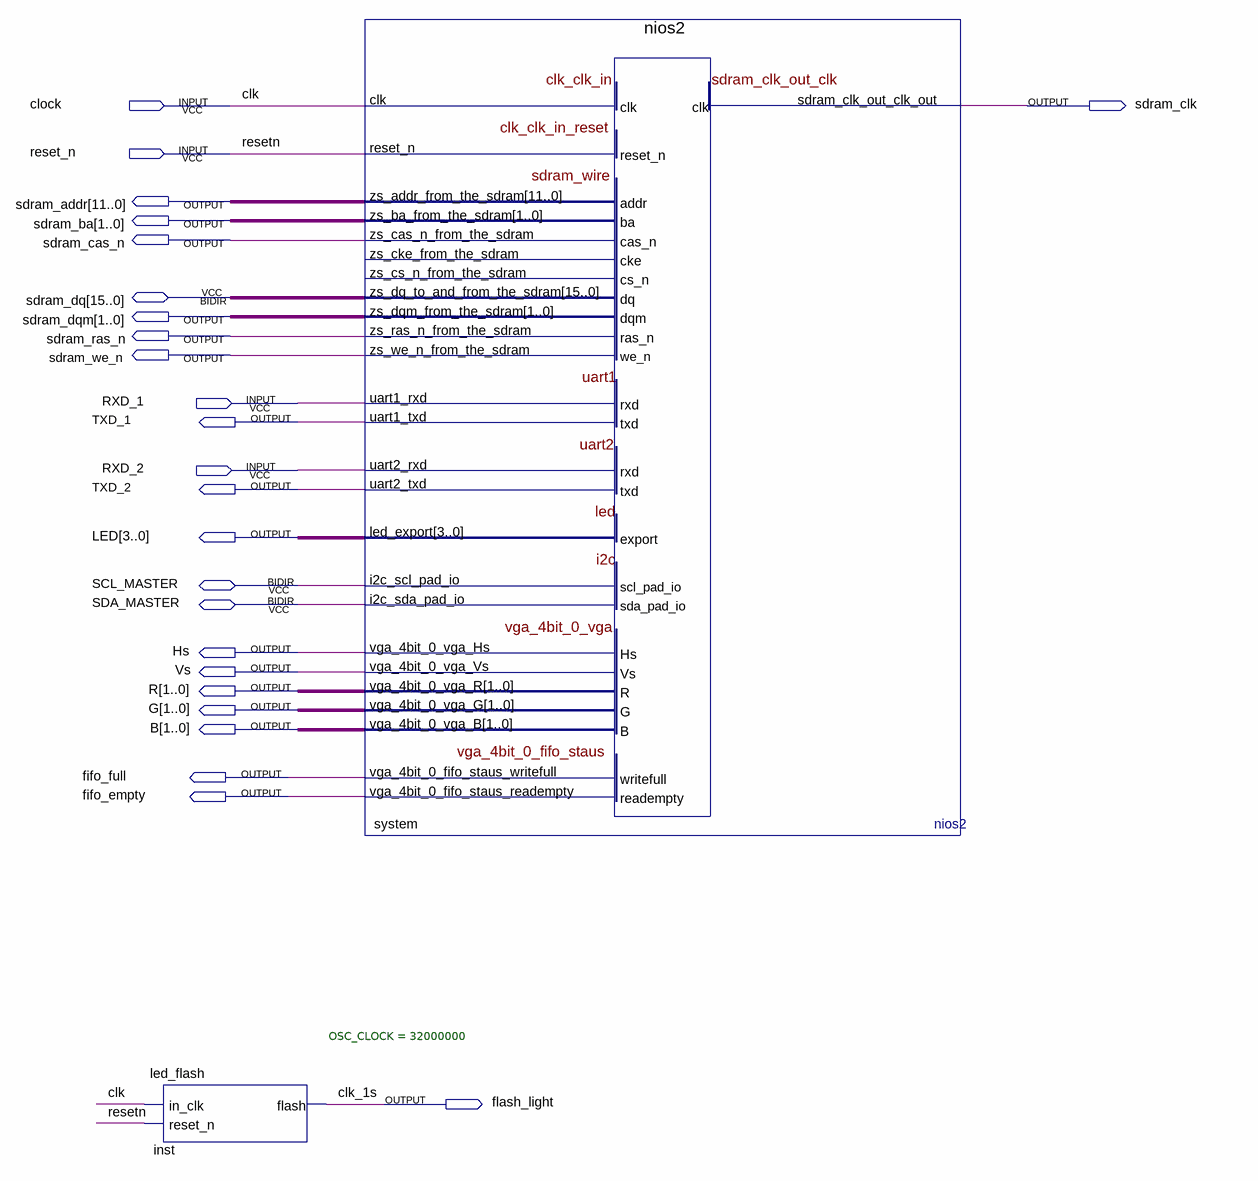
[diagram p0: schematic sheet]
// Quartus schematic EP2C8_Qsys.bdf as structural Verilog: 2 symbols, 25 pins
module EP2C8_Qsys (
  input  clock,
  input  reset_n,
  input  RXD_1,
  input  RXD_2,
  inout  [15:0] sdram_dq,
  inout  SCL_MASTER,
  inout  SDA_MASTER,
  output sdram_clk,
  output [11:0] sdram_addr,
  output [1:0] sdram_ba,
  output sdram_cas_n,
  output [1:0] sdram_dqm,
  output sdram_ras_n,
  output sdram_we_n,
  output TXD_1,
  output TXD_2,
  output [3:0] LED,
  output Hs,
  output Vs,
  output [1:0] R,
  output [1:0] G,
  output [1:0] B,
  output fifo_full,
  output fifo_empty,
  output flash_light
);

  led_flash #(.OSC_CLOCK(32000000)) inst (.in_clk(clock), .reset_n(reset_n), .flash(flash_light));
  nios2 system (
    .clk(clock), .reset_n(reset_n), .uart1_rxd(RXD_1), .uart2_rxd(RXD_2),
    .zs_addr_from_the_sdram(sdram_addr), .zs_ba_from_the_sdram(sdram_ba),
    .zs_cas_n_from_the_sdram(sdram_cas_n), .zs_dqm_from_the_sdram(sdram_dqm),
    .zs_ras_n_from_the_sdram(sdram_ras_n), .zs_we_n_from_the_sdram(sdram_we_n),
    .sdram_clk_out_clk_out(sdram_clk), .uart1_txd(TXD_1), .uart2_txd(TXD_2), .led_export(LED),
    .vga_4bit_0_vga_Hs(Hs), .vga_4bit_0_vga_Vs(Vs), .vga_4bit_0_vga_R(R), .vga_4bit_0_vga_G(G),
    .vga_4bit_0_vga_B(B), .vga_4bit_0_fifo_staus_writefull(fifo_full),
    .vga_4bit_0_fifo_staus_readempty(fifo_empty), .zs_dq_to_and_from_the_sdram(sdram_dq),
    .i2c_scl_pad_io(SCL_MASTER), .i2c_sda_pad_io(SDA_MASTER));  // open: zs_cke_from_the_sdram, zs_cs_n_from_the_sdram

  // Other names for the same wires on the sheet: clk = clock; clk_1s = flash_light; resetn = reset_n
endmodule
